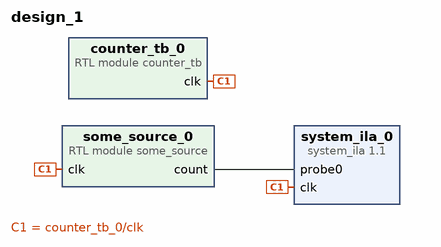
[diagram p0: block diagram of the top level]
# Vivado block design design_1, xc7vx485tffg1157-1, Vivado 2018.2
create_bd_design design_1

create_bd_cell -type module -reference counter_tb counter_tb_0
create_bd_cell -type module -reference some_source some_source_0
create_bd_cell -type ip -vlnv xilinx.com:ip:system_ila:1.1 system_ila_0
set_property -dict {CONFIG.C_PROBE0_TYPE 1 CONFIG.C_NUM_OF_PROBES 1 CONFIG.C_MON_TYPE NATIVE} [get_bd_cells system_ila_0]

# ---- connections ----

connect_bd_net [get_bd_pins counter_tb_0/clk] [get_bd_pins some_source_0/clk] [get_bd_pins system_ila_0/clk]
connect_bd_net -net count [get_bd_pins some_source_0/count] [get_bd_pins system_ila_0/probe0]

validate_bd_design
save_bd_design
